# Altium schematic sheet 2_Non_Volatile_Memories.SchDoc
size A4; Organization: SpaceLab UFSC; Address1: UFSC - SpaceLab; Address2: University Campus - Trindade; Address3: Dep. of Electrical Engineering - CTC; Address4: Florianópolis, Santa Catarina, Brazil; Address5: CEP: 88040 - 900
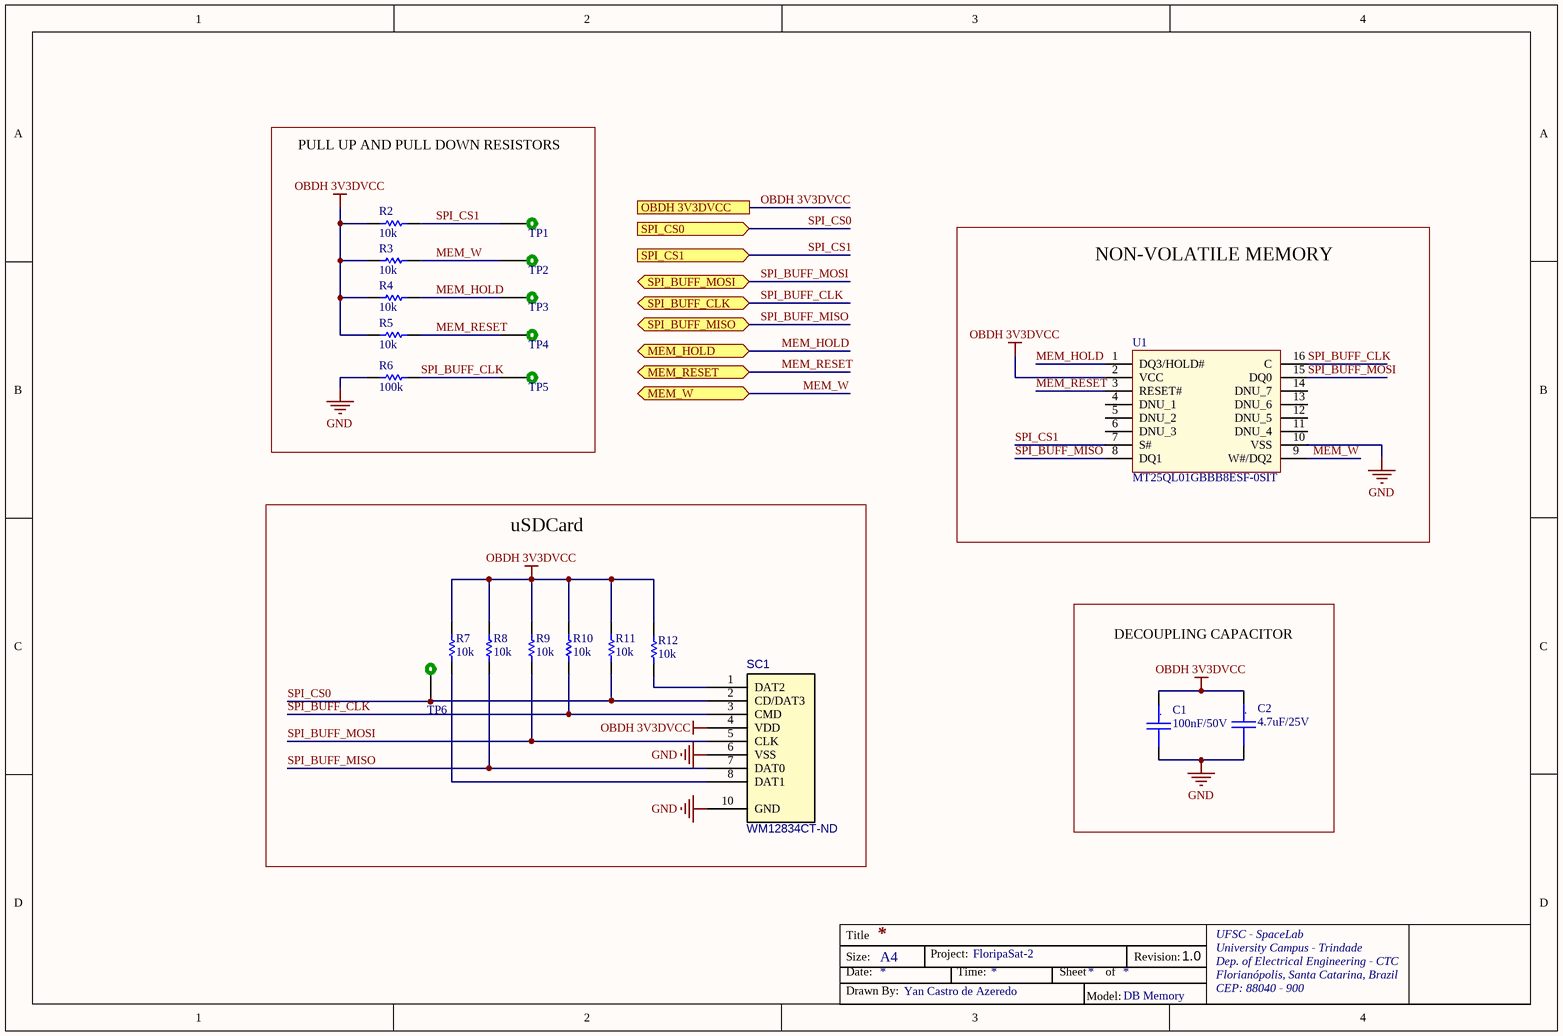
[diagram p0: 2_Non_Volatile_Memories.SchDoc]

## Parts
C1  100nF/50V  [C0603_MD]
C2  4.7uF/25V  [C0805_MD]
R2  10k  [0805]
R3  10k  [0805]
R4  10k  [0805]
R5  10k  [0805]
R6  100k  [0805]
R7  10k  [0805]
R8  10k  [0805]
R9  10k  [0805]
R10  10k  [0805]
R11  10k  [0805]
R12  10k  [0805]
SC1  WM12834CT-ND  [uSD_Card]
TP1  TEST_POINT_2  [TEST_POINT_2]  (value not drawn)  (no BOM)
TP2  TEST_POINT_2  [TEST_POINT_2]  (value not drawn)  (no BOM)
TP3  TEST_POINT_2  [TEST_POINT_2]  (value not drawn)  (no BOM)
TP4  TEST_POINT_2  [TEST_POINT_2]  (value not drawn)  (no BOM)
TP5  TEST_POINT_2  [TEST_POINT_2]  (value not drawn)  (no BOM)
TP6  TEST_POINT_2  [TEST_POINT_2]  (value not drawn)  (no BOM)
U1  MT25QL01GBBB8ESF-0SIT  [SOIC127P1032X265-16N]

## Blocks framed on the sheet
PULL UP AND PULL DOWN RESISTORS: R2-R6 TP1-TP5
NON-VOLATILE MEMORY: U1
uSDCard: R7-R12 SC1 TP6
DECOUPLING CAPACITOR: C1 C2

## Ports
MEM_HOLD (bidir), MEM_RESET (bidir), MEM_W (bidir), OBDH 3V3DVCC, SPI_BUFF_CLK (bidir), SPI_BUFF_MISO (bidir), SPI_BUFF_MOSI (bidir), SPI_CS0 (in), SPI_CS1 (in)

## Nets
GND: C1.2 C2.2 R6.2 SC1.6(VSS) SC1.10(GND) U1.10(VSS)
OBDH 3V3DVCC: C1.1 C2.1 R2.2 R3.2 R4.2 R5.2 R7.2 R8.2 R9.2 R10.2 R11.2 R12.2 SC1.4(VDD) U1.2(VCC) ; port OBDH 3V3DVCC
MEM_HOLD: R4.1 TP3.1 U1.1(DQ3/HOLD#) ; port MEM_HOLD
MEM_RESET: R5.1 TP4.1 U1.3(RESET#) ; port MEM_RESET
MEM_W: R3.1 TP2.1 U1.9(W#/DQ2) ; port MEM_W
SPI_BUFF_CLK: R6.1 R10.1 SC1.3(CMD) TP5.1 U1.16(C) ; port SPI_BUFF_CLK
SPI_BUFF_MISO: R8.1 SC1.7(DAT0) U1.8(DQ1) ; port SPI_BUFF_MISO
SPI_BUFF_MOSI: R9.1 SC1.5(CLK) U1.15(DQ0) ; port SPI_BUFF_MOSI
SPI_CS0: R11.1 SC1.2(CD/DAT3) TP6.1 ; port SPI_CS0
SPI_CS1: R2.1 TP1.1 U1.7(S#) ; port SPI_CS1
NetR7_1: R7.1 SC1.8(DAT1)
NetR12_1: R12.1 SC1.1(DAT2)

Not connected (* = marked no-connect by the designer): U1 4(DNU_1) 5(DNU_2) 6(DNU_3) 11(DNU_4) 12(DNU_5) 13(DNU_6) 14(DNU_7)

## Notes on the sheet
- FloripaSat-2
- 1.0
- Yan Castro de Azeredo
- DB Memory
- Title
- Size:
- Date:
- A4
- Project:
- Time:
- Sheet
- of
- Revision:
- UFSC - SpaceLab
- University Campus - Trindade
- Dep. of Electrical Engineering - CTC
- Florianópolis, Santa Catarina, Brazil
- CEP: 88040 - 900
- Drawn By:
- Model:
- (in symbol Cap_Cer_X7R_4.7uF_25V_0805) .
- (in symbol Cap_Cer_X7R_100nF_50V_0603) .

## Library data of the parts
C1 = Cap_Cer_X7R_100nF_50V_0603: CAP CER 100nF 50V 0603 10%; Partnumber: C0603C104K5RAC3121; NCM: 8532.24.10
C2 = Cap_Cer_X7R_4.7uF_25V_0805: CAP CER 4.7UF 25V 10% X7R 0805; Partnumber: C0805C475K3RACAUTO; NCM: 8532.24.10
R2-R5 R7-R12 = R10k_1%_1/8W_0805: RES 10K OHM 1/8W 1%  0805; Partnumber: CRCW080510K0FKEA; NCM: 8533.21.20
R6 = R100k_1%_1/8W_0805: RES 100K OHM 1/8W 1% 0805; Partnumber: AC0805FR-13100KL; NCM: 8533.21.20
SC1 = MicroSD_Card_Connector: MicroSD CARD Connector; Partnumber: WM12834CT-ND; NCM: 8536.90.40
TP1-TP6 = TEST_POINT_2: Test point
U1 = MT25QL01GBBB8ESF-0SIT: IC FLASH 1GBIT 108MHZ 16SOIC; Manufacturer_Name: Micron; Geometry.Height: 2.65mm; Manufacturer_Part_Number: MT25QL01GBBB8ESF-0SIT; Mouser Part Number: 340-278808-TRAY; Mouser Price/Stock: https://www.mouser.com/Search/Refine.aspx?Keyword=340-278808-TRAY; RS Part Number: *; RS Price/Stock: *; Datasheet Link: https://www.micron.com/~/media/documents/products/data-sheet/nor-flash/serial-nor/mt25q/die-rev-b/mt25q_qlkt_l_01g_bbb_0.pdf